# Altium schematic sheet ADC.SchDoc
size A
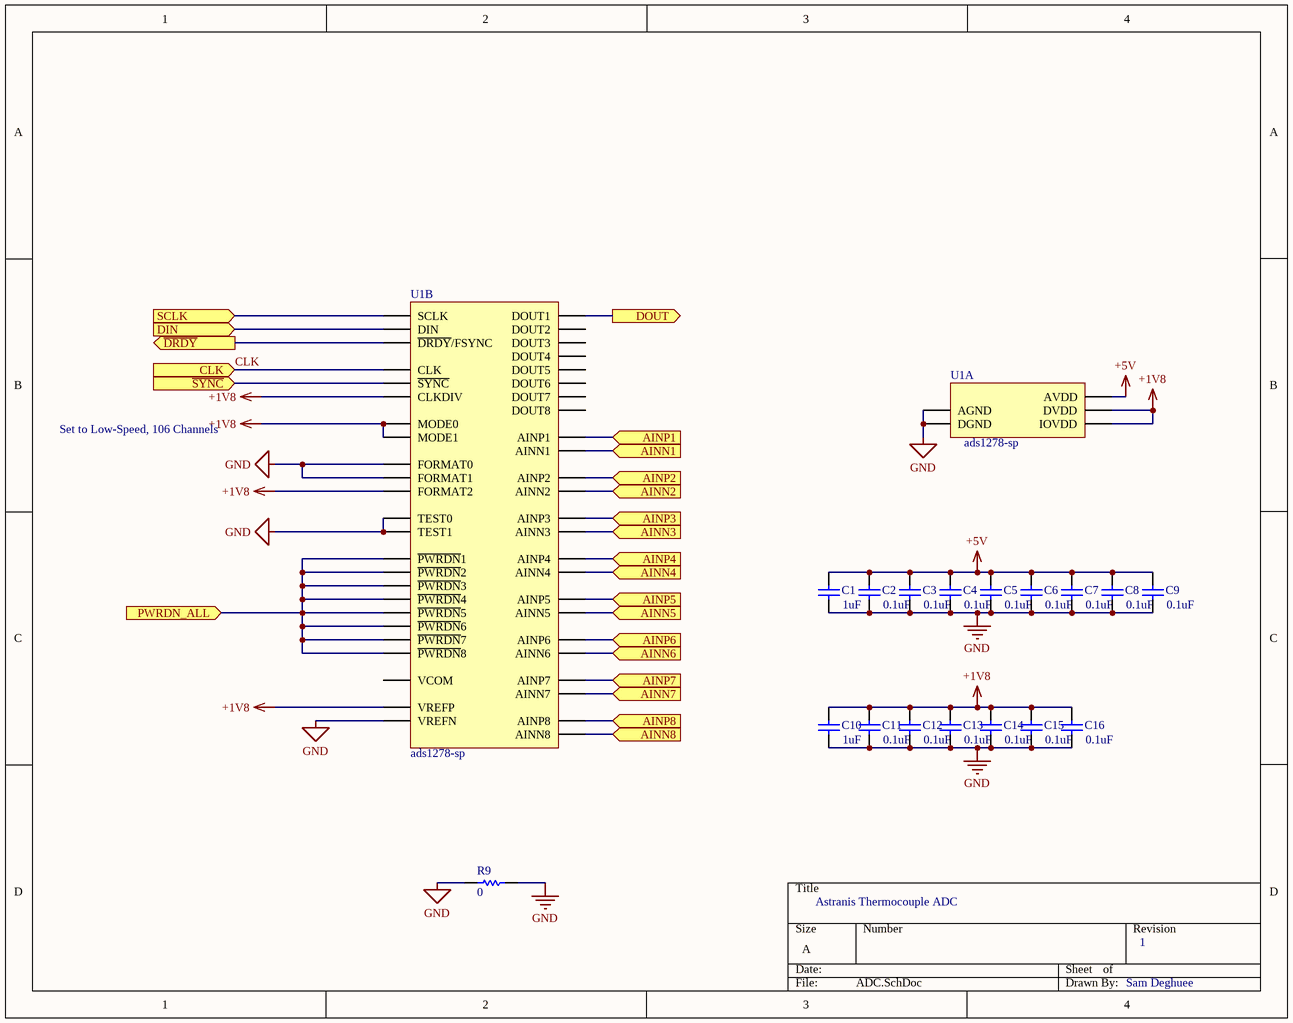
[diagram p0: ADC.SchDoc]

## Parts
C1  value 1uF  [CAPC0603(1608)100_L]  (hidden comment: CAP0603)
C2  value 0.1uF  [CAPC0603(1608)100_L]  (hidden comment: CAP0603)
C3  value 0.1uF  [CAPC0603(1608)100_L]  (hidden comment: CAP0603)
C4  value 0.1uF  [CAPC0603(1608)100_L]  (hidden comment: CAP0603)
C5  value 0.1uF  [CAPC0603(1608)100_L]  (hidden comment: CAP0603)
C6  value 0.1uF  [CAPC0603(1608)100_L]  (hidden comment: CAP0603)
C7  value 0.1uF  [CAPC0603(1608)100_L]  (hidden comment: CAP0603)
C8  value 0.1uF  [CAPC0603(1608)100_L]  (hidden comment: CAP0603)
C9  value 0.1uF  [CAPC0603(1608)100_L]  (hidden comment: CAP0603)
C10  value 1uF  [CAPC0603(1608)100_L]  (hidden comment: CAP0603)
C11  value 0.1uF  [CAPC0603(1608)100_L]  (hidden comment: CAP0603)
C12  value 0.1uF  [CAPC0603(1608)100_L]  (hidden comment: CAP0603)
C13  value 0.1uF  [CAPC0603(1608)100_L]  (hidden comment: CAP0603)
C14  value 0.1uF  [CAPC0603(1608)100_L]  (hidden comment: CAP0603)
C15  value 0.1uF  [CAPC0603(1608)100_L]  (hidden comment: CAP0603)
C16  value 0.1uF  [CAPC0603(1608)100_L]  (hidden comment: CAP0603)
R9  value 0  [RESC0603(1608)_L]  (hidden comment: RES0603)
U1  ads1278-sp  (parts A,B of 2)

## Ports
AINN1 (in), AINN2 (in), AINN3 (in), AINN4 (in), AINN5 (in), AINN6 (in), AINN7 (in), AINN8 (in), AINP1 (in), AINP2 (in), AINP3 (in), AINP4 (in), AINP5 (in), AINP6 (in), AINP7 (in), AINP8 (in), CLK (in), DIN (in), DOUT (out), PWRDN_ALL (in), SCLK (in), ~{DRDY} (out), ~{SYNC} (in)

## Nets
+1V8: C10.2 C11.2 C12.2 C13.2 C14.2 C15.2 C16.2 U1.?5(CLKDIV) U1.?6(MODE0) U1.?7(MODE1) U1.?10(FORMAT2) U1.?22(VREFP) U1.DVDD U1.IOVDD
+5V: C1.2 C2.2 C3.2 C4.2 C5.2 C6.2 C7.2 C8.2 C9.2 U1.AVDD
GND: C1.1 C2.1 C3.1 C4.1 C5.1 C6.1 C7.1 C8.1 C9.1 C10.1 C11.1 C12.1 C13.1 C14.1 C15.1 C16.1 R9.1 R9.2 U1.?8(FORMAT0) U1.?9(FORMAT1) U1.?11(TEST0) U1.?12(TEST1) U1.?23(VREFN) U1.AGND U1.DGND
AINN1: U1.?40(AINN1) ; port AINN1
AINN2: U1.?41(AINN2) ; port AINN2
AINN3: U1.?42(AINN3) ; port AINN3
AINN4: U1.?43(AINN4) ; port AINN4
AINN5: U1.?44(AINN5) ; port AINN5
AINN6: U1.?45(AINN6) ; port AINN6
AINN7: U1.?46(AINN7) ; port AINN7
AINN8: U1.?47(AINN8) ; port AINN8
AINP1: U1.?32(AINP1) ; port AINP1
AINP2: U1.?33(AINP2) ; port AINP2
AINP3: U1.?34(AINP3) ; port AINP3
AINP4: U1.?35(AINP4) ; port AINP4
AINP5: U1.?36(AINP5) ; port AINP5
AINP6: U1.?37(AINP6) ; port AINP6
AINP7: U1.?38(AINP7) ; port AINP7
AINP8: U1.?39(AINP8) ; port AINP8
CLK: U1.?3(CLK) ; port CLK
~{DRDY}: U1.?2(~{DRDY}/FSYNC) ; port ~{DRDY}
DIN: U1.?1(DIN) ; port DIN
DOUT: U1.?24(DOUT1) ; port DOUT
PWRDN_ALL: U1.?13(~{PWRDN}1) U1.?14(~{PWRDN}2) U1.?15(~{PWRDN}3) U1.?16(~{PWRDN}4) U1.?17(~{PWRDN}5) U1.?18(~{PWRDN}6) U1.?19(~{PWRDN}7) U1.?20(~{PWRDN}8) ; port PWRDN_ALL
~{SYNC}: U1.?4(~{SYNC}) ; port ~{SYNC}
SCLK: U1.SCLK ; port SCLK

Not connected (* = marked no-connect by the designer): U1 ?21(VCOM) ?25(DOUT2) ?26(DOUT3) ?27(DOUT4) ?28(DOUT5) ?29(DOUT6) ?30(DOUT7) ?31(DOUT8)

## Notes on the sheet
- Set to Low-Speed, 106 Channels
- Astranis Thermocouple ADC
- 1
- Sam Deghuee

## Library data of the parts
C1-C16 = CMP-1590-00005-1: 0603 (1608 Metric) Chip Capacitor; Case-Metric: 1608; Case-EIA: 0603; PackageReference: CAPC0603(1608)100
R9 = CMP-1591-00001-1: 0603 (1608 Metric) Chip Resistor; Case-Metric: 1608; Case-EIA: 0603; PackageReference: RESC0603(1608)
U1 = ads1278-sp: The ADS1278-SP (octal) is a 24-bit, delta-sigma (ΔΣ) analog-to-digital converter (ADC) with data rates up to 128k samples per second (SPS), allowing simultaneous sampling of eight channels.; ComponentLink1Description: Datasheet; ComponentLink1URL: http://www.ti.com/lit/ds/symlink/ads1278-sp.pdf